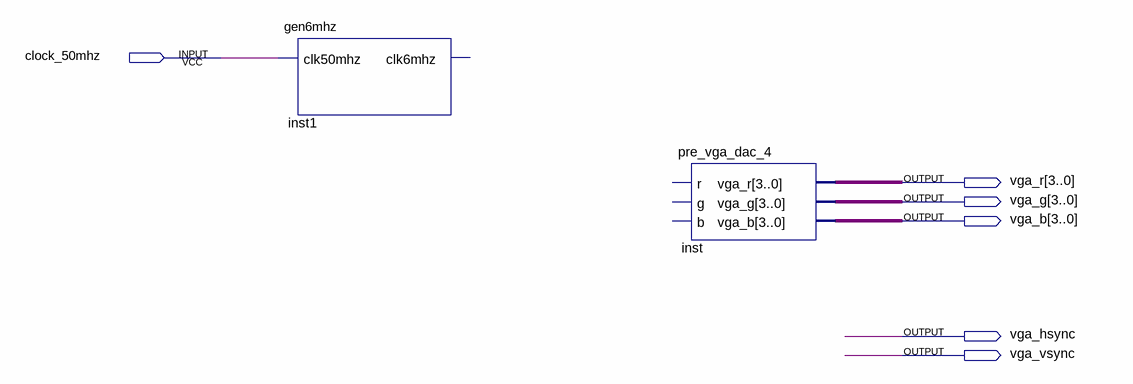
[diagram p0: schematic sheet]
// Quartus schematic top_de1.bdf as structural Verilog: 2 symbols, 6 pins
module top_de1 (
  input  clock_50mhz,
  output [3:0] vga_r,
  output [3:0] vga_g,
  output [3:0] vga_b,
  output vga_hsync,
  output vga_vsync
);

  gen6mhz inst1 (.clk50mhz(clock_50mhz));  // open: clk6mhz
  pre_vga_dac_4 inst (.vga_r(vga_r), .vga_g(vga_g), .vga_b(vga_b));  // open: r, g, b
endmodule
